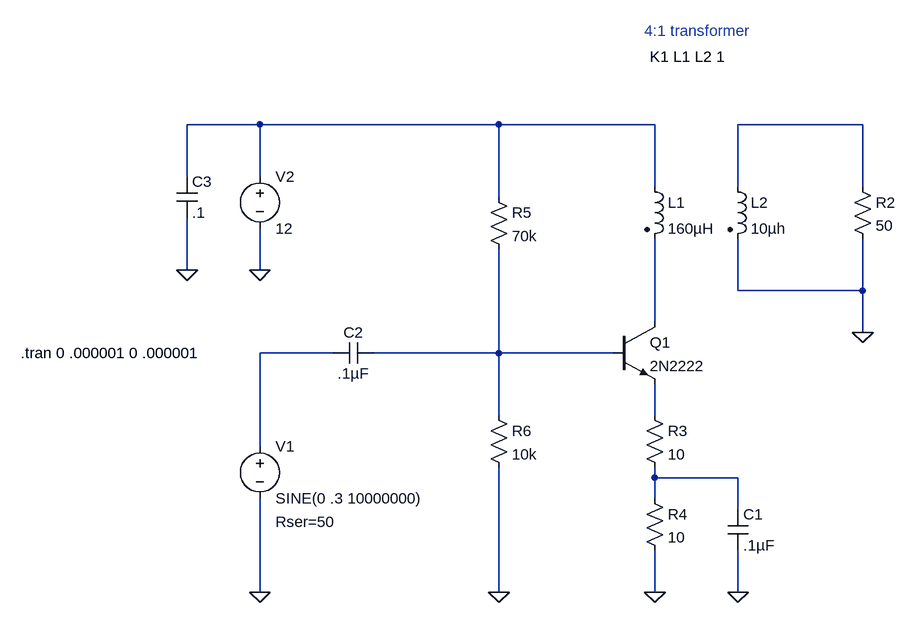
[diagram p0: schematic m0hbr1.asc]
m0hbr1.asc, the LTspice schematic file:
Version 4
SHEET 1 904 704
WIRE -624 0 -624 -80
WIRE -624 144 -624 64
WIRE -512 -80 -624 -80
WIRE -512 0 -512 -80
WIRE -512 144 -512 80
WIRE -512 416 -512 272
WIRE -512 640 -512 496
WIRE -400 272 -512 272
WIRE -144 -80 -512 -80
WIRE -144 32 -144 -80
WIRE -144 272 -336 272
WIRE -144 272 -144 112
WIRE -144 368 -144 272
WIRE -144 640 -144 448
WIRE 32 272 -144 272
WIRE 96 -80 -144 -80
WIRE 96 16 96 -80
WIRE 96 224 96 96
WIRE 96 368 96 320
WIRE 96 464 96 448
WIRE 96 496 96 464
WIRE 96 640 96 576
WIRE 224 16 224 -80
WIRE 224 176 224 96
WIRE 224 464 96 464
WIRE 224 512 224 464
WIRE 224 640 224 576
WIRE 416 -80 224 -80
WIRE 416 16 416 -80
WIRE 416 176 224 176
WIRE 416 176 416 96
WIRE 416 240 416 176
FLAG 96 640 0
FLAG 224 640 0
FLAG -144 640 0
FLAG -512 640 0
FLAG -512 144 0
FLAG 416 240 0
FLAG -624 144 0
SYMBOL npn 32 224 R0
SYMATTR InstName Q1
SYMATTR Value 2N2222
SYMBOL ind2 80 0 R0
SYMATTR InstName L1
SYMATTR Value 160µH
SYMATTR Type ind
SYMBOL ind2 208 0 R0
SYMATTR InstName L2
SYMATTR Value 10µh
SYMATTR Type ind
SYMBOL res 400 0 R0
SYMATTR InstName R2
SYMATTR Value 50
SYMBOL res 80 352 R0
SYMATTR InstName R3
SYMATTR Value 10
SYMBOL res 80 480 R0
SYMATTR InstName R4
SYMATTR Value 10
SYMBOL cap 208 512 R0
SYMATTR InstName C1
SYMATTR Value .1µF
SYMBOL res -160 16 R0
SYMATTR InstName R5
SYMATTR Value 70k
SYMBOL res -160 352 R0
SYMATTR InstName R6
SYMATTR Value 10k
SYMBOL cap -336 256 R90
WINDOW 0 0 32 VBottom 0
WINDOW 3 32 32 VTop 0
SYMATTR InstName C2
SYMATTR Value .1µF
SYMBOL voltage -512 400 R0
WINDOW 123 0 0 Left 0
WINDOW 39 24 132 Left 0
SYMATTR SpiceLine Rser=50
SYMATTR InstName V1
SYMATTR Value SINE(0 .3 10000000)
SYMBOL voltage -512 -16 R0
WINDOW 123 0 0 Left 0
WINDOW 39 0 0 Left 0
SYMATTR InstName V2
SYMATTR Value 12
SYMBOL cap -640 0 R0
SYMATTR InstName C3
SYMATTR Value .1
TEXT 80 -224 Left 0 ;4:1 transformer
TEXT 88 -184 Left 0 !K1 L1 L2 1
TEXT -880 272 Left 0 !.tran 0 .000001 0 .000001

The netlist it stands for:
* m0hbr1.asc
Q1 N004 N003 N005 0 2N2222
L1 N001 N004 160µH
L2 N007 0 10µh
R2 N007 0 50
R3 N005 N006 10
R4 N006 0 10
C1 N006 0 .1µF
R5 N001 N003 70k
R6 N003 0 10k
C2 N003 N002 .1µF
V1 N002 0 SINE(0 .3 10000000) Rser=50
V2 N001 0 12
C3 N001 0 .1
.model NPN NPN
.model PNP PNP
.lib standard.bjt
* 4:1 transformer
K1 L1 L2 1
.tran 0 .000001 0 .000001
.backanno
.end